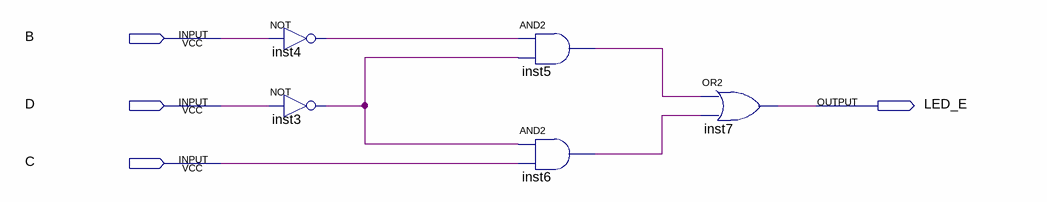
[diagram p0: schematic sheet]
// Quartus schematic led_e.bdf as structural Verilog: 5 symbols, 4 pins
module led_e (
  input  B,
  input  D,
  input  C,
  output LED_E
);

  wire inst3_out, inst4_out, inst5_out, inst6_out;

  not inst4 (inst4_out, B);
  not inst3 (inst3_out, D);
  and inst5 (inst5_out, inst4_out, inst3_out);
  and inst6 (inst6_out, inst3_out, C);
  or inst7 (LED_E, inst5_out, inst6_out);
endmodule
